# Altium schematic sheet XBeeLight.SchDoc
size A4
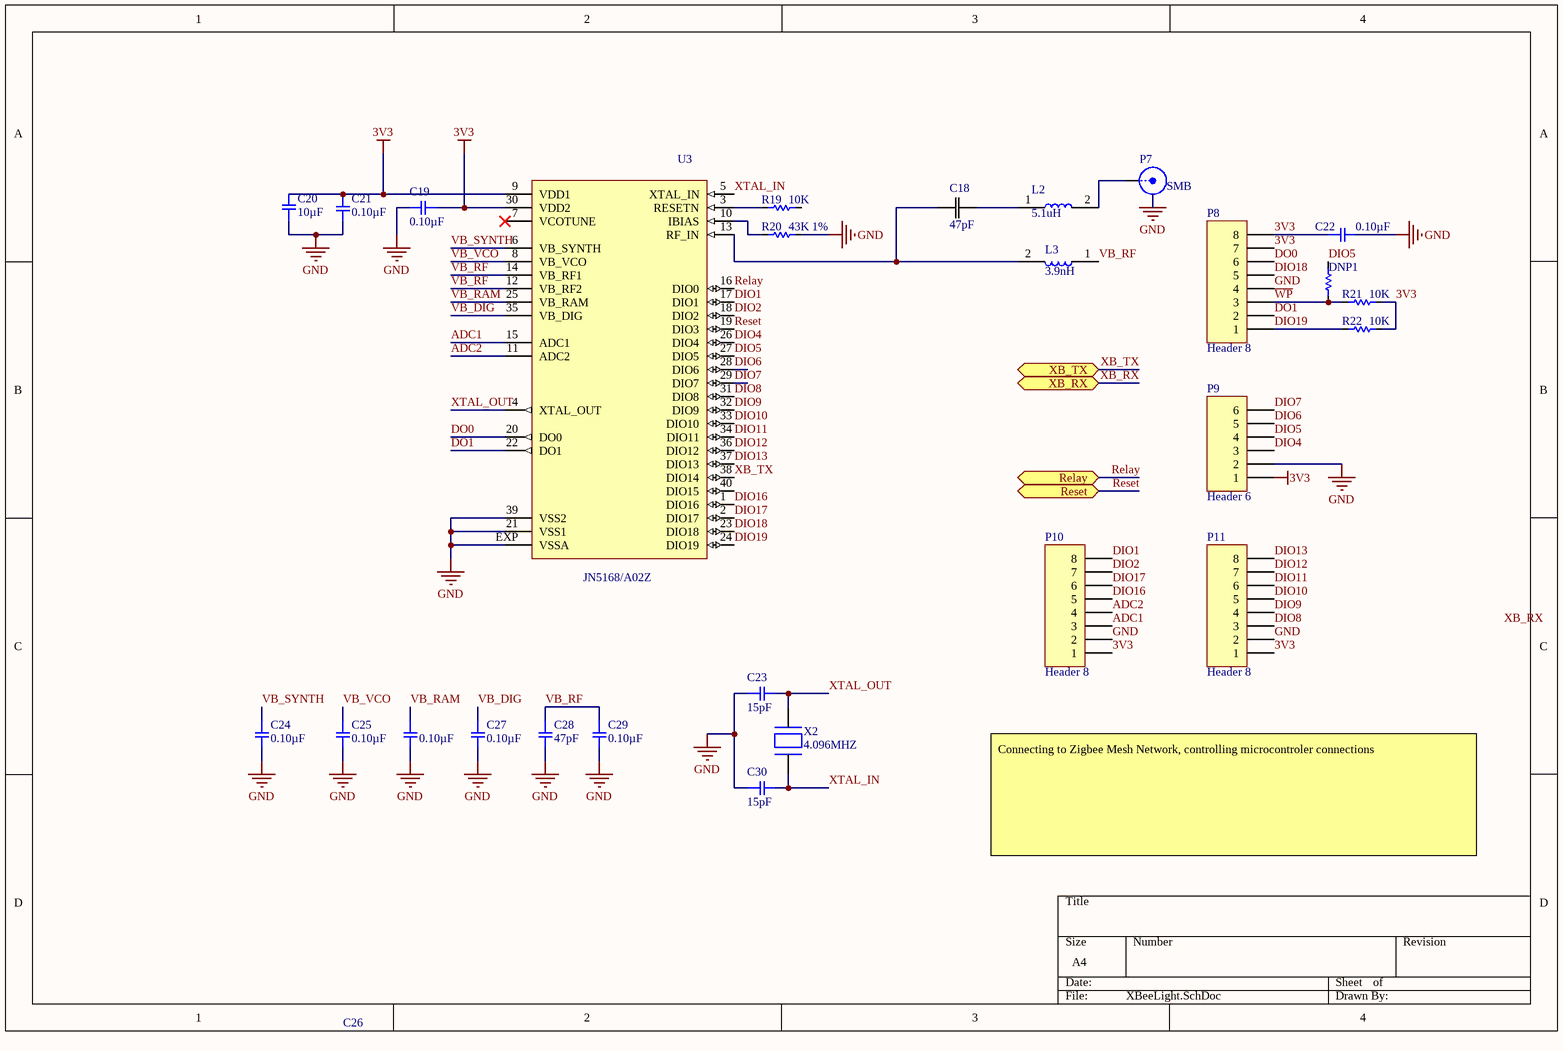
[diagram p0: XBeeLight.SchDoc]

## Parts
C18  47pF  [CC0402N]
C19  0.10µF  [SMD-0402C]
C20  10µF  [SMD-0603C]
C21  0.10µF  [SMD-0402C]
C22  0.10µF  [SMD-0402C]
C23  15pF  [SMD-0402C]
C24  0.10µF  [SMD-0402C]
C25  0.10µF  [SMD-0402C]
C26  0.10µF  [SMD-0402C]
C27  0.10µF  [SMD-0402C]
C28  47pF  [SMD-0402C]
C29  0.10µF  [SMD-0402C]
C30  15pF  [SMD-0402C]
DNP1  10K  [MCS 0402]  (value not drawn)
L2  5.1uH  [INDC1005X45]
L3  3.9nH  [INDC1005X45]
P7  SMB  [SMB_V-RJ45]
P8  Header 8  [HDR1X8]
P9  Header 6  [HDR1X6]
P10  Header 8  [HDR1X8]
P11  Header 8  [HDR1X8]
R19  10K  [MCS 0402]
R20  43K 1%  [RC0402N]
R21  10K  [MCS 0402]
R22  10K  [MCS 0402]
U3  JN5168/A02Z  [QFN50P600X600X100-41N_JN5168/A02Z(Primary)]
X2  4.096MHZ  [XTAL_ABLS2-4.096MHZ-D4Y-T]

## Ports
Relay (bidir), Reset (bidir), XB_RX (bidir), XB_TX (bidir)

## Nets
3V3: C19.1 C20.2 C21.1 C22.1 P8.7 P8.8 P9.1 P10.1 P11.1 R21.2 R22.2 U3.9(VDD1) U3.30(VDD2)
GND: C19.2 C20.1 C21.2 C22.2 C23.1 C24.2 C25.2 C26.2 C27.2 C28.2 C29.2 C30.1 P7.2(Y) P8.4 P9.2 P10.2 P11.2 R20.2 U3.21(VSS1) U3.39(VSS2) U3.EXP(VSSA)
ADC1: P10.3 U3.15(ADC1)
ADC2: P10.4 U3.11(ADC2)
DIO1: P10.8 U3.17(DIO1)
DIO2: P10.7 U3.18(DIO2)
DIO4: P9.3 U3.26(DIO4)
DIO5: DNP1.2 P9.4 U3.27(DIO5)
DIO6: P9.5 U3.28(DIO6)
DIO7: P9.6 U3.29(DIO7)
DIO8: P11.3 U3.31(DIO8)
DIO9: P11.4 U3.32(DIO9)
DIO10: P11.5 U3.33(DIO10)
DIO11: P11.6 U3.34(DIO11)
DIO12: P11.7 U3.36(DIO12)
DIO13: P11.8 U3.37(DIO13)
DIO16: P10.5 U3.1(DIO16)
DIO17: P10.6 U3.2(DIO17)
DIO18: P8.5 U3.23(DIO18)
DIO19: P8.1 R22.1 U3.24(DIO19)
DO0: P8.6 U3.20(DO0)
DO1: P8.2 U3.22(DO1)
Relay: U3.16(DIO0) ; port Relay
Reset: U3.19(DIO3) ; port Reset
VB_DIG: C27.1 U3.35(VB_DIG)
VB_RAM: C26.1 U3.25(VB_RAM)
VB_RF: C28.1 C29.1 L3.1 U3.12(VB_RF2) U3.14(VB_RF1)
VB_SYNTH: C24.1 U3.6(VB_SYNTH)
VB_VCO: C25.1 U3.8(VB_VCO)
~{WP}: DNP1.1 P8.3 R21.1
XB_RX: port XB_RX
XB_TX: U3.38(DIO14) ; port XB_TX
XTAL_IN: C30.2 U3.5(XTAL_IN) X2.1
XTAL_OUT: C23.2 U3.4(XTAL_OUT) X2.2
NetC18_1: C18.1 L2.1
NetC18_2: C18.2 L3.2 U3.13(RF_IN)
NetL2_2: L2.2 P7.1(X)
NetR19_1: R19.1 U3.3(RESETN)
NetR20_1: R20.1 U3.10(IBIAS)

Not connected (* = marked no-connect by the designer): R19 2; U3 7(VCOTUNE)* 40(DIO15)

## Notes on the sheet
- Connecting to Zigbee Mesh Network, controlling microcontroler connections
- Labels drawn without touching a wire or pin: XB_RX

## Library data of the parts
C18 = CC0402JRNPO9BN47: Imported; Manufacturer_Part_Number: CC0402JRNPO9BN470; Vendor: Yageo; Built_By: EMA_UL_Team; Type: DEV; C: Copyright (C) 2015 Accelerated Designs. All rights reserved; RefDes: RefDes; Value: Value
C19 C21 C22 C24-C27 C29 = GCM155R71C104KA55D: CAP CER 0.1UF 16V X7R 0402; Manufacturer: Murata Electronics North America; Factory Stock: 0; Unit Price (USD): 0.1; Minimum Quantity: 1; Tolerance: ±10%; Datasheets: http://www.murata.com/~/media/webrenewal/support/library/catalog/products/capacitor/mlcc/c03e.ashx; Image: //media.digikey.com/Renders/Murata%20Renders/ZRB-SERIES-0402.jpg; Digi-Key Part Number: 490-4759-1-ND; Part Number: GCM155R71C104KA55D; Quantity Available: 734194; @ qty: 0; Packaging: Cut Tape (CT); Series: GCM; Part Status: Active; Value: 0.10µF; Voltage: 16V; Temperature Coefficient: X7R; Operating Temperature: -55°C ~ 125°C; Features: -; Ratings: AEC-Q200; Applications: Automotive; Mounting Type: Surface Mount, MLCC; Package / Case: 0402 (1005 Metric); Size / Dimension: 0.039" L x 0.020" W (1.00mm x 0.50mm); Height - Seated (Max): -; Thickness (Max): 0.022" (0.55mm); Lead Spacing: -; Lead Style: -
C20 = GRM188R60J106KE47D: CAP CER 10UF 6.3V X5R 0603; Manufacturer: Murata Electronics North America; Factory Stock: 0; Unit Price (USD): 0.13; Minimum Quantity: 1; Tolerance: ±10%; Datasheets: http://www.murata.com/~/media/webrenewal/support/library/catalog/products/capacitor/mlcc/c02e.pdf; Image: //media.digikey.com/Renders/Murata%20Renders/ZRB-SERIES-0402.jpg; Digi-Key Part Number: 490-12538-1-ND; Part Number: GRM188R60J106KE47D; Quantity Available: 3805; @ qty: 0; Packaging: Cut Tape (CT); Series: GRM; Part Status: Active; Value: 10µF; Voltage: 6.3V; Temperature Coefficient: X5R; Operating Temperature: -55°C ~ 85°C; Features: -; Ratings: -; Applications: General Purpose; Mounting Type: Surface Mount, MLCC; Package / Case: 0603 (1608 Metric); Size / Dimension: 0.063" L x 0.031" W (1.60mm x 0.80mm); Height - Seated (Max): -; Thickness (Max): 0.035" (0.90mm); Lead Spacing: -; Lead Style: -
C23 C30 = GJM1555C1H150FB01D: CAP CER 15PF 50V NP0 0402; Manufacturer: Murata Electronics North America; Factory Stock: 0; Unit Price (USD): 0.21; Minimum Quantity: 1; Tolerance: ±1%; Temperature Coefficient: C0G, NP0; Datasheets: http://www.murata.com/~/media/webrenewal/support/library/catalog/products/capacitor/mlcc/c02e.pdf; Image: //media.digikey.com/Renders/Murata%20Renders/ZRB-SERIES-0402.jpg; Digi-Key Part Number: 490-11191-1-ND; Part Number: GJM1555C1H150FB01D; Quantity Available: 36038; @ qty: 0; Packaging: Cut Tape (CT); Series: GJM; Part Status: Active; Value: 15pF; Voltage: 50V; Operating Temperature: -55°C ~ 125°C; Features: High Q, Low Loss; Ratings: -; Applications: RF, Microwave, High Frequency; Mounting Type: Surface Mount, MLCC; Package / Case: 0402 (1005 Metric); Size / Dimension: 0.039" L x 0.020" W (1.00mm x 0.50mm); Height - Seated (Max): -; Thickness (Max): 0.022" (0.55mm); Lead Spacing: -; Lead Style: -
C28 = GCM1555C1H470JA16D: CAP CER 47PF 50V NP0 0402; Manufacturer: Murata Electronics North America; Factory Stock: 0; Unit Price (USD): 0.1; Minimum Quantity: 1; Tolerance: ±5%; Temperature Coefficient: C0G, NP0; Datasheets: http://www.murata.com/~/media/webrenewal/support/library/catalog/products/capacitor/mlcc/c03e.ashx; Image: //media.digikey.com/Renders/Murata%20Renders/ZRB-SERIES-0402.jpg; Digi-Key Part Number: 490-10670-1-ND; Part Number: GCM1555C1H470JA16D; Quantity Available: 171; @ qty: 0; Packaging: Cut Tape (CT); Series: GCM; Part Status: Active; Value: 47pF; Voltage: 50V; Operating Temperature: -55°C ~ 125°C; Features: -; Ratings: AEC-Q200; Applications: Automotive; Mounting Type: Surface Mount, MLCC; Package / Case: 0402 (1005 Metric); Size / Dimension: 0.039" L x 0.020" W (1.00mm x 0.50mm); Height - Seated (Max): -; Thickness (Max): 0.022" (0.55mm); Lead Spacing: -; Lead Style: -
DNP1 R19 R21 R22 = 10K Res: Res Thin Film 0402 10K Ohm 0.5% 0.063W(1/16W) ±25ppm/C Molded SMD Automotive Punched T/R; Manufacturer: Panasonic; Manufacturer Part Number: ERA-2AED103X; Resistance: 10 kO; Temp Coefficient: ±25 ppm/°C; Supplier 1: Digi-Key; Stock 1: 99513; Pricing 1: 1=0.22, 10=0.188, 100=0.0735, 1000=0.0308, 2500=0.0282, 5000=0.0256 (USD); Rated Power: 0.063 W; Size Code: 0402; Tolerance (%): ±0.5 %; ComponentLink1URL: https://datasheet.ciiva.com/43470/1776116-43470437.pdf; ComponentLink1Description: https://datasheet.ciiva.com/43470/1776116-43470437.pdf; ComponentLink2URL: https://datasheet.ciiva.com/7830/1776116-7830919.pdf; ComponentLink2Description: https://datasheet.ciiva.com/7830/1776116-7830919.pdf; ComponentLink3URL: https://datasheet.ciiva.com/30240/54aoa0000ce26-30240474.pdf; ComponentLink3Description: https://datasheet.ciiva.com/30240/54aoa0000ce26-30240474.pdf; ComponentLink4URL: https://datasheet.ciiva.com/46378/1776116-46378235.pdf; ComponentLink4Description: https://datasheet.ciiva.com/46378/1776116-46378235.pdf; Supplier Part Number 1: P10KDECT-ND
L2 = LQP15MN5N1B02D: Inductor RF Chip Unshielded Thin Film 5.1nH 0.1nH 500MHz 13Q-Factor Ceramic 140mA 700mOhm DCR 0402 T/R; MF: Murata; Package: 0402 Murata; Digi-Key_Part_Number: 490-6758-1-ND; Digi-Key_Purchase_URL: https://www.digikey.lk/product-detail/en/murata-electronics-north-america/LQP15MN5N1B02D/490-6758-1-ND/3845955?utm_source=snapeda&utm_medium=aggregator&utm_campaign=symbol; SnapEDA_Link: https://www.snapeda.com/parts/LQP15MN5N1B02D/Murata%20Electronics%20North%20America/view-part/?ref=snap; MP: LQP15MN5N1B02D; Value: *
L3 = LQP15MN3N9B02D: FIXED IND 3.9NH 170MA 500 MOHM; Manufacturer: Murata; Product Training Modules: Inductor Products Chip RF Inductors; Catalog Drawings: LQP15M Series Top LQP15M Series Side; Type: Thin Film; Material - Core: Non-Magnetic; Tolerance: ±0.1nH; Shielding: Unshielded; DC Resistance (DCR): 500 mOhm Max; Q @ Freq: 13 @ 500MHz; Frequency - Self Resonant: 6GHz; Frequency - Test: 500MHz; Online Catalog: LQP Series; Other Names: 490-1131-2 / LQP10A3N9B02T1; Supplier 1: Digi-Key; Manufacturer Part Number: LQP15MN3N9B02D; Stock 1: 110804; Pricing 1: 1=0.19, 10=0.173, 100=0.1152, 500=0.096, 1000=0.0807, 2500=0.0691 (USD); Standard Package: 10,000; Category: Inductors, Coils, Chokes; Family: Fixed Inductors; Series: LQP15M; Packaging: Tape & Reel (TR); Inductance: 3.9nH; Current Rating: 170mA; Operating Temperature: -40°C ~ 85°C; Mounting Type: Surface Mount; Package / Case: 0402 (1005 Metric); Size / Dimension: 0.039" L x 0.020" W (1.00mm x 0.50mm); Height - Seated (Max): 0.018" (0.45mm); ComponentLink1URL: http://search.murata.co.jp/Ceramy/image/img/PDF/ENG/L0075S0084LQP15M.pdf; ComponentLink1Description: http://search.murata.co.jp/Ceramy/image/img/PDF/ENG/L0075S0084LQP15M.pdf; ComponentLink2URL: https://www.murata.com/~/media/webrenewal/support/library/catalog/products/inductor/chip/o05e.ashx; ComponentLink2Description: https://www.murata.com/~/media/webrenewal/support/library/catalog/products/inductor/chip/o05e.ashx; ComponentLink3URL: http://www.jameco.com/Jameco/Products/ProdDS/1865137.pdf; ComponentLink3Description: http://www.jameco.com/Jameco/Products/ProdDS/1865137.pdf; ComponentLink4URL: https://www.murata.com/~/media/webrenewal/support/library/catalog/products/inductor/chip/o05e.ashx?la=en-us; ComponentLink4Description: https://www.murata.com/~/media/webrenewal/support/library/catalog/products/inductor/chip/o05e.ashx?la=en-us; ComponentLink5URL: http://uk.rs-online.com/webdocs/0f15/0900766b80f155d9.pdf; ComponentLink5Description: http://uk.rs-online.com/webdocs/0f15/0900766b80f155d9.pdf; Supplier Part Number 1: 490-1131-1-ND
P7 = SMB: SMB Straight Connector; LatestRevisionDate: 17-Jul-2002; LatestRevisionNote: Re-released for DXP Platform.; Publisher: Altium Limited
P8 P10 P11 = Header 8: Header, 8-Pin; LatestRevisionDate: 17-Jul-2002; LatestRevisionNote: Re-released for DXP Platform.; Publisher: Altium Limited
P9 = Header 6: Header, 6-Pin; LatestRevisionDate: 17-Jul-2002; LatestRevisionNote: Re-released for DXP Platform.; Publisher: Altium Limited
R20 = Res 43K: Imported; Manufacturer_Part_Number: ERJ-2RKF4302X; Vendor: Panasonic; Built_By: EMA_UL_Team; C: Copyright (C) 2015 Accelerated Designs. All rights reserved; RefDes: RefDes; Type: DEV; Value: Value
U3 = JN5168/A02Z: JN5168 - ZigBee, RF4CE, JenNet-IP and IEEE802.15.4 wireless microcontroller with 256 kB Flash, 32 kB RAM; MF: NXP Semiconductors; Availability: Unavailable; Price: None; Package: None; SnapEDA_Link: https://www.snapeda.com/parts/JN5168/A02Z/NXP%20Semiconductors/view-part/?ref=snap; MP: JN5168/A02Z; Value: *
X2 = ABLS2-4.096MHZ-D4Y-T: 4.096MHz ±30ppm Crystal 18pF 180 Ohm -40°C ~ 85°C  Surface Mount HC49/US; Manufacturer: Abracon; ESR: 180 ohm; Frequency Stability: ?30 ppm; Frequency Tolerance: ?30; Mode of Oscillation: Fundamental; Product Depth (mm): 4.7 mm; Product Length (mm): 11.4 mm; Screening Level: Industrial; Supplier 1: Digi-Key; Manufacturer Part Number: ABLS2-4.096MHZ-D4Y-T; Stock 1: 6062; Pricing 1: 1=0.46, 10=0.385, 50=0.3466, 100=0.308, 500=0.2926 (USD); Frequency: 4.096 MHz; Load Capacitance: 18 pF; Mounting Style: Surface Mount; Operating Temp Range: -40C to 85C; Package / Case: HC-49/US; Packaging: Tape and Reel; Type: Crystal; ComponentLink1URL: http://www.abracon.com/Resonators/ABLS2.pdf; ComponentLink1Description: http://www.abracon.com/Resonators/ABLS2.pdf; ComponentLink2URL: https://abracon.com/Resonators/ABLS2.pdf; ComponentLink2Description: https://abracon.com/Resonators/ABLS2.pdf; ComponentLink3URL: http://www.farnell.com/datasheets/1749648.pdf; ComponentLink3Description: http://www.farnell.com/datasheets/1749648.pdf; Supplier Part Number 1: 535-9858-1-ND